# Altium schematic sheet usb.SchDoc
size 292 x 193 mm; SheetNumber: 2; SheetTotal: 5
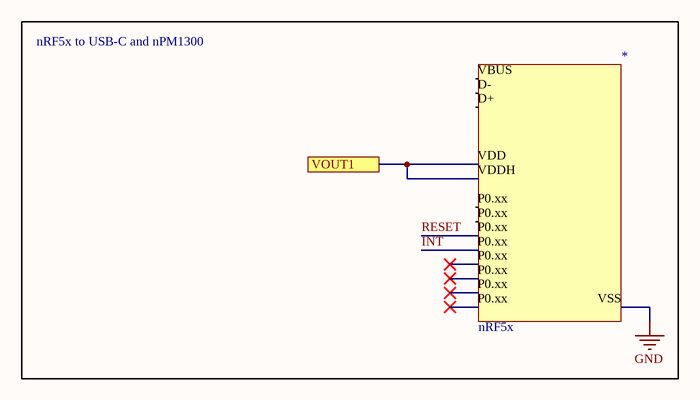
[diagram p0: usb.SchDoc]

## Parts
*  nRF5x

## Blocks framed on the sheet
nRF5x to USB-C and nPM1300: *

## Ports
VOUT1

## Nets
GND: *.VSS
INT: *.P0.xx
RESET: *.P0.xx
VOUT1: *.VDD *.VDDH ; port VOUT1

Not connected (* = marked no-connect by the designer): * D+ D- VBUS

## Notes on the sheet
- Data:
- Tytuł:
- Rev.:
- Rozm.:
- A4
- Strona:
- z
- PBL4
- Opracował:

## Library data of the parts
* = nRF5x: SOIC127P600X175-8N, 2 3 or 4 compatible